# Altium project LOAD CONTROL_Final.PrjPcb
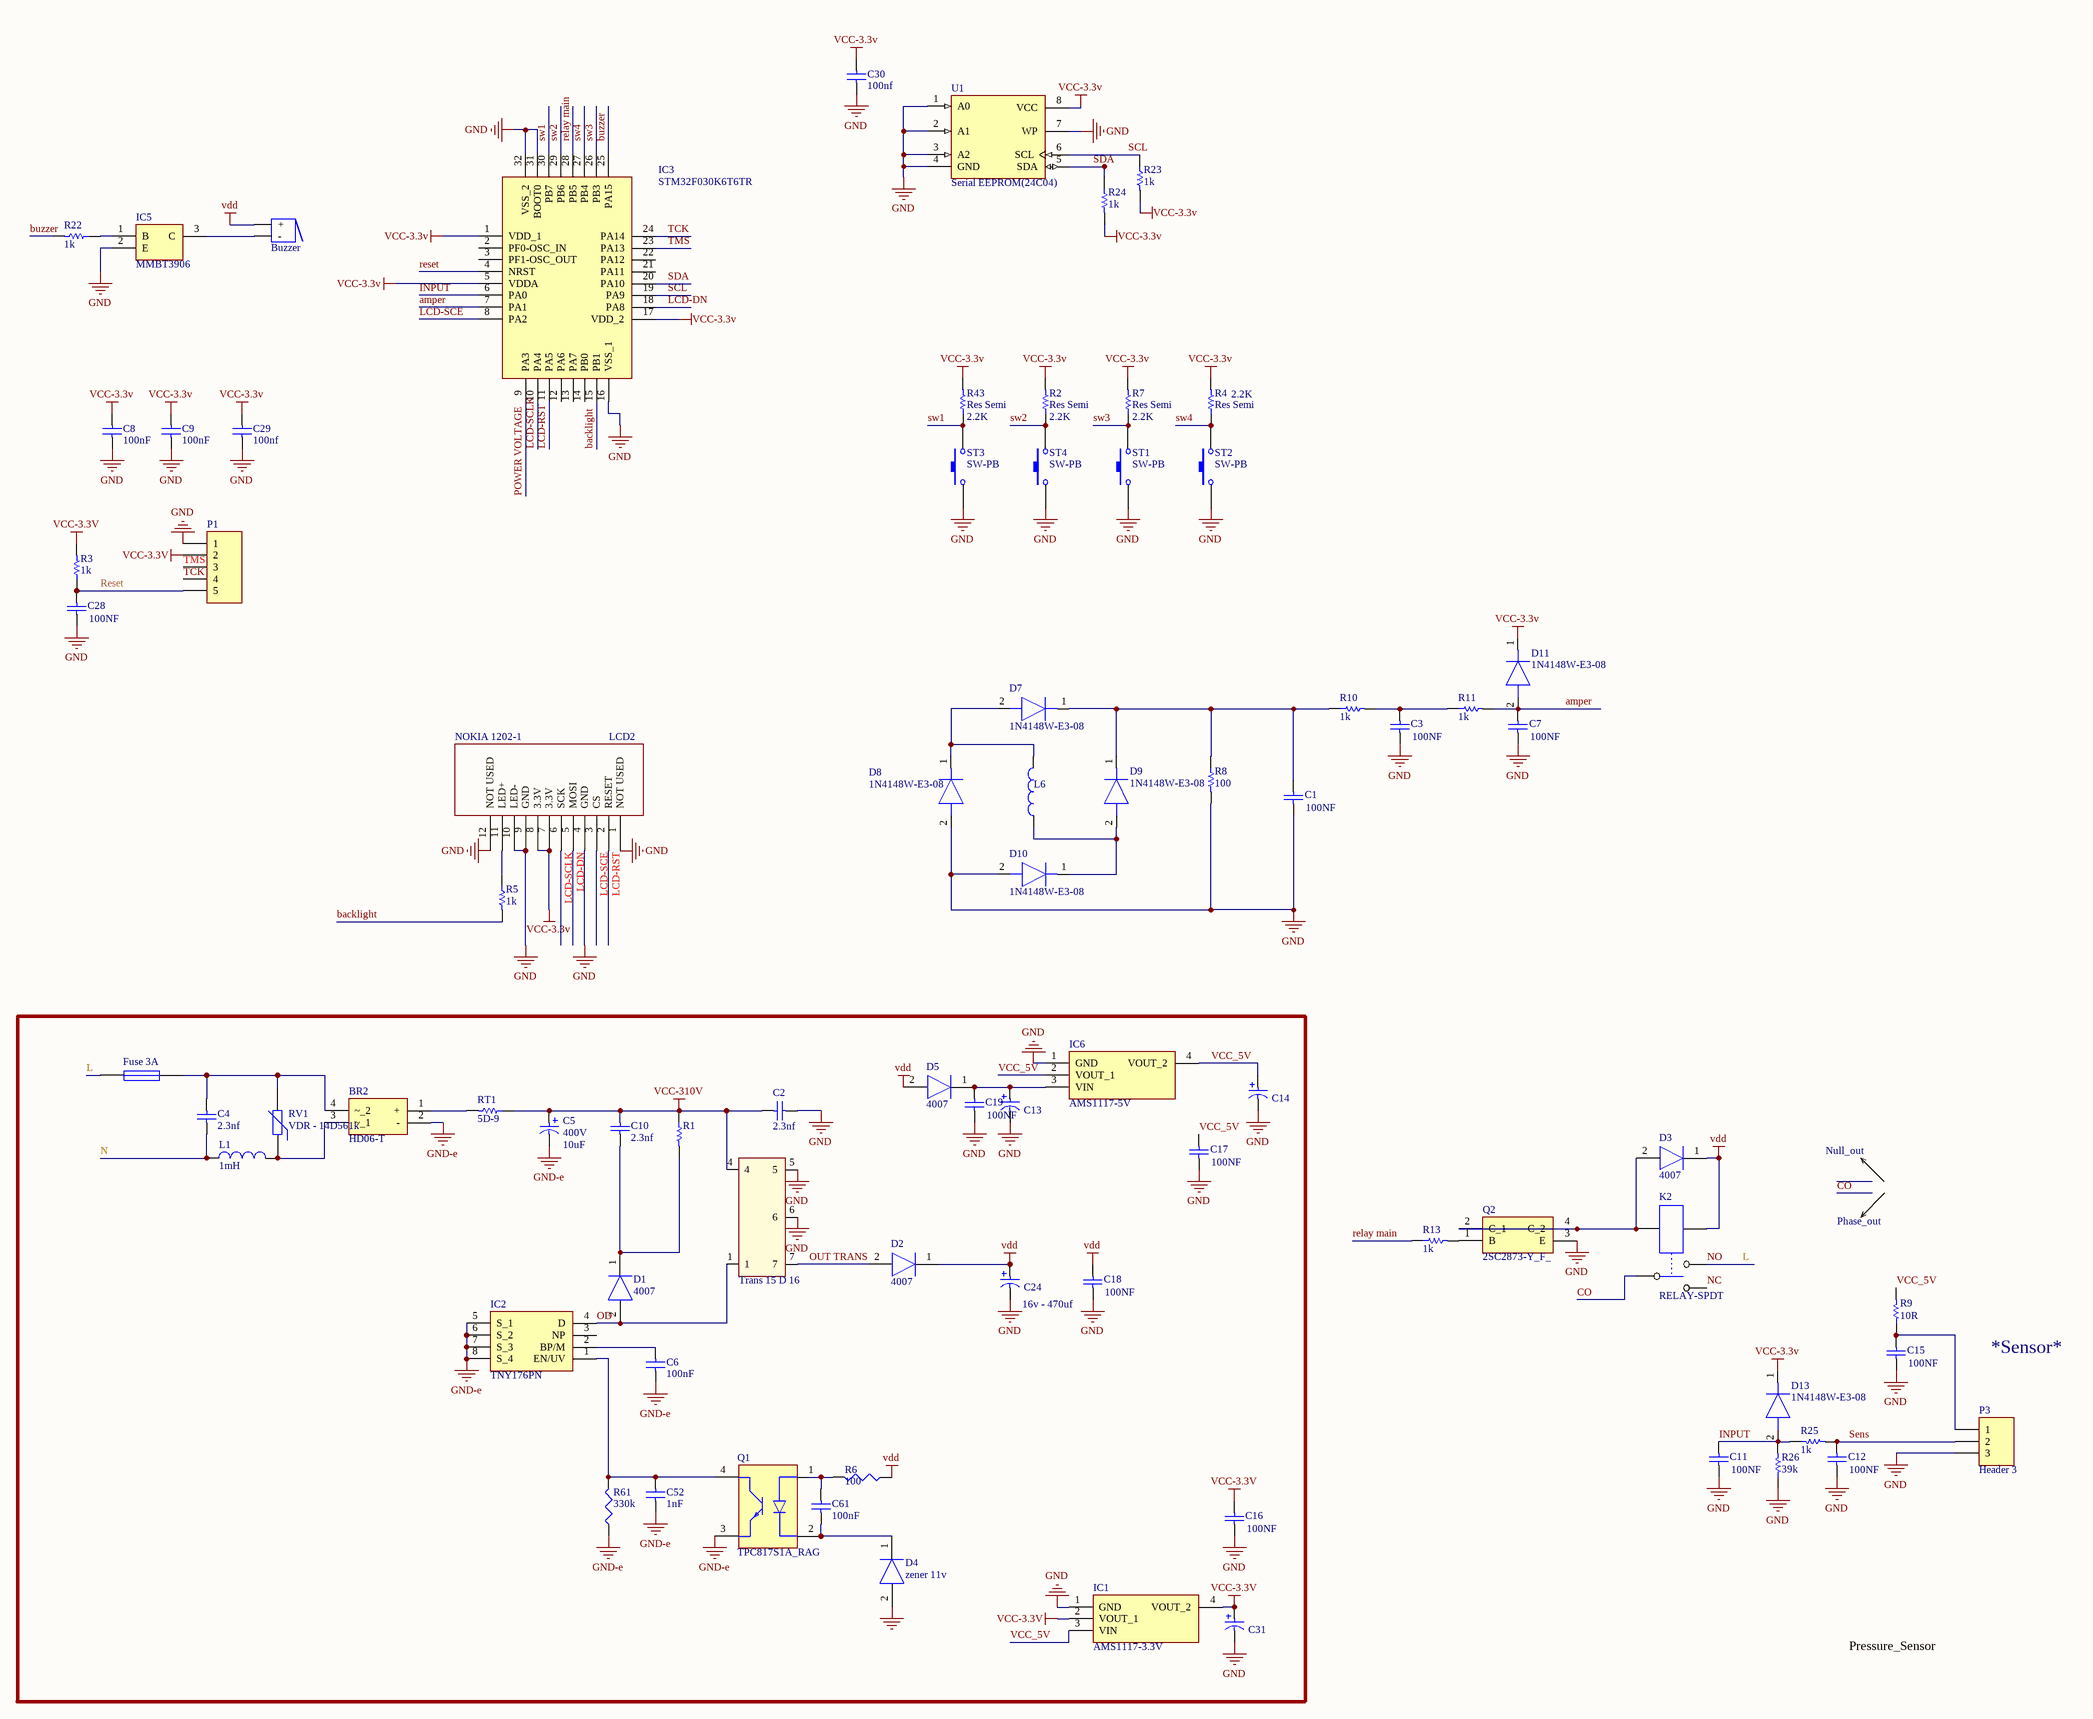
[diagram p0: LOAD CONTROL_Final2.SchDoc]
1 sheet, 80 parts. Net scope: global (net labels, ports and power ports of the same name join across sheets).
Board file: LOAD CONTROL_Final2.PcbDoc

## Sheet LOAD CONTROL_Final2.SchDoc
size A2

### Parts
BR2  HD06-T  [SOP250P700X270-4N]
Buzzer  Buzzer  [BUZZER]  (value not drawn)
C1  100NF  [c1206]
C2  2.3nf  [VAR 5MM]
C3  100NF  [c1206]
C4  2.3nf  [VAR 5MM]
C5  400V  value 10uF  [RADIAL 12MM]
C6  100nF  [C1206]
C7  100NF  [c1206]
C8  100nF  [c1206]
C9  100nF  [c1206]
C10  2.3nf  [VAR 5MM]
C11  100NF  [c1206]
C12  100NF  [c1206]
C13  35v - 100uf  [RADIAL 5MM]  (value not drawn)
C14  35v - 100uf  [RADIAL 5MM]  (value not drawn)
C15  100NF  [c1206]
C16  100NF  [c1206]
C17  100NF  [c1206]
C18  100NF  [c1206]
C19  100NF  [c1206]
C24  16v - 470uf  [RADIAL 5MM]
C28  100NF  [c1206]
C29  100nf  [c1206]
C30  100nf  [C1206]
C31  35v - 100uf  [RADIAL 5MM]  (value not drawn)
C52  1nF  [c1206]
C61  100nF  [c1206]
D1  4007  [sma]
D2  4007  [sma]
D3  4007  [sma]
D4  zener 11v  [SOD3716X135N]
D5  4007  [sma]
D7  1N4148W-E3-08  [SOD3716X135N]
D8  1N4148W-E3-08  [SOD3716X135N]
D9  1N4148W-E3-08  [SOD3716X135N]
D10  1N4148W-E3-08  [SOD3716X135N]
D11  1N4148W-E3-08  [SOD3716X135N]
D13  1N4148W-E3-08  [SOD3716X135N]
Fuse_3A  Fuse 1  [FUSE1206]  (value not drawn)
IC1  AMS1117-3.3V  [SOT229P700X180-4N]
IC2  TNY176PN  [DIP8]
IC3  STM32F030K6T6TR  [QFP80P900X900X160-32N]
IC5  MMBT3906  [SOT95P240X120-3N]
IC6  AMS1117-5V  [SOT229P700X180-4N]
K2  RELAY-SPDT  [T91]
L1  1mH  [inductor 0.25w]
L6  0  [ZMC]  (value not drawn)
NOKIA_1202-1  LCD2  [LCD NOKIA 1202]
P1  Header 5  [HDR1X5]  (value not drawn)
P3  Header 3  [3PIN]
Q1  TPC817S1A_RAG  [SOP259P1005X368-4N]
Q2  2SC2873-Y_F_  [2SC5819TE12LF]
R1  0.22 oh _ 5%  [RES 2W H]  (value not drawn)
R2  Res Semi  value 2.2K  [R1206]
R3  value 1k  [R1206]  (hidden comment: Res Semi)
R4  Res Semi  value 2.2K  [R1206]
R5  value 1k  [R1206]  (hidden comment: Res Semi)
R6  value 100  [R1206]  (hidden comment: 1206)
R7  Res Semi  value 2.2K  [R1206]
R8  value 100  [R1206]  (hidden comment: Res Semi)
R9  value 10R  [R1206]  (hidden comment: Res Semi)
R10  value 1k  [R1206]  (hidden comment: Res Semi)
R11  value 1k  [R1206]  (hidden comment: Res Semi)
R13  value 1k  [R1206]  (hidden comment: Res Semi)
R22  value 1k  [R1206]  (hidden comment: Res Semi)
R23  value 1k  [R1206]  (hidden comment: Res Semi)
R24  value 1k  [R1206]  (hidden comment: Res Semi)
R25  value 1k  [R1206]  (hidden comment: Res Semi)
R26  value 39k  [R1206]  (hidden comment: Res Semi)
R43  Res Semi  value 2.2K  [R1206]
R61  330k  [R1206]
RT1  5D-9  [VAR 5MM]
RV1  VDR - 14D561k  [VAR 5MM]
ST1  SW-PB  [PUSH BOTTOM 6*6]
ST2  SW-PB  [PUSH BOTTOM 6*6]
ST3  SW-PB  [PUSH BOTTOM 6*6]
ST4  SW-PB  [PUSH BOTTOM 6*6]
TR1  Trans 15 D 16  [EE20]
U1  Serial EEPROM(24C04)  [SO8_L]

### Nets
GND: C1.1 C2.2 C3.1 C7.1 C8.2 C9.2 C11.1 C12.1 C13.1 C14.1 C15.1 C16.1 C17.1 C18.1 C19.1 C24.1 C28.1 C29.1 C30.1 C31.1 D4.2(A) D8.2(A) D10.2(A) IC1.1(GND) IC3.16(VSS_1) IC3.31(BOOT0) IC3.32(VSS_2) IC5.2(E) IC6.1(GND) NOKIA_1202-1.1(NOT_USED) NOKIA_1202-1.4(GND) NOKIA_1202-1.9(GND) NOKIA_1202-1.10(LED-) NOKIA_1202-1.12(NOT_USED) P1.1 P3.3 Q2.3(E) R8.2 R26.1 ST1.1 ST2.1 ST3.1 ST4.1 TR1.5 TR1.6 U1.1(A0) U1.2(A1) U1.3(A2) U1.4(GND) U1.7(WP)
GND-e: BR2.2(-) C5.2 C6.2 C52.2 IC2.5(S_1) IC2.6(S_2) IC2.7(S_3) IC2.8(S_4) Q1.3(EMITTER) R61.1
VCC-3.3V: C8.1 C9.1 C16.2 C29.2 C30.2 C31.2 D11.1(K) D13.1(K) IC1.2(VOUT_1) IC1.4(VOUT_2) IC3.1(VDD_1) IC3.5(VDDA) IC3.17(VDD_2) NOKIA_1202-1.7(3.3V) NOKIA_1202-1.8(3.3V) P1.2 R2.2 R3.2 R4.2 R7.2 R23.2 R24.2 R43.2 U1.8(VCC)
VCC-310V: C2.1 C5.1 C10.1 R1.1 RT1.1 TR1.4
vdd: Buzzer.1(+) C18.2 C24.2 D2.1(K) D3.1(K) D5.2(A) K2.5 R6.1
amper: C7.2 D11.2(A) IC3.7(PA1) R11.2
backlight: IC3.15(PB1) R5.2
buzzer: IC3.25(PA15) R22.2
CO: K2.1
INPUT: C11.2 D13.2(A) IC3.6(PA0) R25.1 R26.2
L: Fuse_3A.1 K2.3  [also labelled NO]
LCD-DN: IC3.18(PA8) NOKIA_1202-1.5(MOSI)
LCD-RST: IC3.11(PA5) NOKIA_1202-1.2(RESET)
LCD-SCE: IC3.8(PA2) NOKIA_1202-1.3(CS)
LCD-SCLK: IC3.10(PA4) NOKIA_1202-1.6(SCK)
N: C4.2 L1.1
NC: K2.2
OD: D1.2(A) IC2.4(D) TR1.1
OUT TRANS: D2.2(A) TR1.7
POWER VOLTAGE: IC3.9(PA3)
relay main: IC3.28(PB5) R13.1
Reset: C28.2 IC3.4(NRST) P1.5 R3.1
SCL: IC3.19(PA9) R23.1 U1.6(SCL)
SDA: IC3.20(PA10) R24.1 U1.5(SDA)
Sens: C12.2 P3.2 R25.2
sw1: IC3.30(PB7) R43.1 ST3.2
sw2: IC3.29(PB6) R2.1 ST4.2
sw3: IC3.26(PB3) R7.1 ST1.2
sw4: IC3.27(PB4) R4.1 ST2.2
TCK: IC3.24(PA14) P1.4
TMS: IC3.23(PA13) P1.3
VCC_5V: C14.2 C17.2 IC1.3(VIN) IC6.2(VOUT_1) IC6.4(VOUT_2) R9.2
NetBR2_1: BR2.1(+) RT1.2
NetBR2_3: BR2.3(~_1) L1.2 RV1.1
NetBR2_4: BR2.4(~_2) C4.1 Fuse_3A.2 RV1.2
NetBuzzer_2: Buzzer.2(-) IC5.3(C)
NetC1_2: C1.2 D7.1(K) D9.1(K) R8.1 R10.1
NetC3_2: C3.2 R10.2 R11.1
NetC6_1: C6.1 IC2.2(BP/M)
NetC10_2: C10.2 D1.1(K) R1.2
NetC13_2: C13.2 C19.2 D5.1(K) IC6.3(VIN)
NetC15_2: C15.2 P3.1 R9.1
NetC52_1: C52.1 IC2.1(EN/UV) Q1.4(COLLECTOR) R61.2
NetC61_1: C61.1 Q1.1(ANODE) R6.2
NetC61_2: C61.2 D4.1(K) Q1.2(CATHODE)
NetD3_2: D3.2(A) K2.4 Q2.2(C_1) Q2.4(C_2)
NetD7_2: D7.2(A) D8.1(K) L6.2
NetD9_2: D9.2(A) D10.1(K) L6.1
NetIC5_1: IC5.1(B) R22.1
NetNOKIA_1202-1_11: NOKIA_1202-1.11(LED+) R5.1
NetQ2_1: Q2.1(B) R13.2

Not connected (* = marked no-connect by the designer): IC2 3(NP); IC3 2(PF0-OSC_IN) 3(PF1-OSC_OUT) 12(PA6) 13(PA7) 14(PB0) 21(PA11) 22(PA12)

### Notes on the sheet
- Null_out
- Phase_out
- *Sensor*
- Pressure_Sensor

### Library data of the parts
BR2 = HD06-T: Bridge Rectifier; Manufacturer_Name: Diodes Inc.; Allied_Number: 70438301; Datasheet Link: https://www.diodes.com/assets/Datasheets/ds17003.pdf; Height: 2.7mm; Manufacturer_Part_Number: HD06-T; Mouser Part Number: 621-HD06T; Mouser Price/Stock: https://www.mouser.com/Search/Refine.aspx?Keyword=621-HD06T; RS Part Number: 7385033; RS Price/Stock: https://uk.rs-online.com/web/p/products/7385033; Allied Price/Stock: https://www.alliedelec.com/diodes-inc-hd06-t/70438301/
Buzzer = Buzzer: Designer: Seyed Mohsen Ghasemain; ComponentLinkURL: www.picpars.com
C1 C3 C6-C9 C11 C12 C15-C19 C28-C30 C52 C61 = Cap Semi: Capacitor (Semiconductor SIM Model); Value: 10PF; Published: 8-Jun-2000; LatestRevisionDate: 29-May-2009; LatestRevisionNote: IPC-7351 Footprint Added.; PackageReference: C1206; Publisher: Altium Limited; PackageDescription: Chip Capacitor
C2 C4 C10 = Cap: Capacitor - SMD; Value: 100pF; Published: 8-Jun-2000; LatestRevisionDate: 17-Jul-2002; LatestRevisionNote: Re-released for DXP Platform.; PackageReference: RAD-0.3; Publisher: Altium Limited; PackageDescription: Radial Cap, Thru-Hole; 2 Leads; 0.3 in Pin Spacing
C5 = CAP_22uF_400V
C13 C14 C24 C31 = CAP 470uF 16V: Electrolytic Capacitor; Value: 1500uF
D1-D5 = 1N5819HW-7-F: Diode; Manufacturer_Name: Diodes Inc.; Allied_Number: 70437201; Datasheet Link: http://www.diodes.com/_files/datasheets/ds30217.pdf; Height: 1.45mm; Manufacturer_Part_Number: 1N5819HW-7-F; Mouser Part Number: 621-1N5819HW-F; Mouser Price/Stock: https://www.mouser.com/Search/Refine.aspx?Keyword=621-1N5819HW-F; RS Part Number: 7082197P; RS Price/Stock: http://uk.rs-online.com/web/p/products/7082197P; Allied Price/Stock: http://www.alliedelec.com/diodes-inc-1n5819hw-7-f/70437201/
D7-D11 D13 = 1N4148W-E3-08: Diode; Manufacturer_Name: Vishay; Datasheet Link: http://www.vishay.com/docs/85748/1n4148w.pdf; Height: 1.35mm; Manufacturer_Part_Number: 1N4148W-E3-08; Mouser Part Number: 78-1N4148W-E3-08; Mouser Price/Stock: https://www.mouser.co.uk/ProductDetail/Vishay-Semiconductors/1N4148W-E3-08?qs=bTzheeSci6TVjpxfjjRVMw%3D%3D; Arrow Part Number: 1N4148W-E3-08; Arrow Price/Stock: https://www.arrow.com/en/products/1n4148w-e3-08/vishay?region=nac
Fuse_3A = Fuse 1: Fuse; Published: 8-Jun-2000; LatestRevisionDate: 17-Jul-2002; LatestRevisionNote: Re-released for DXP Platform.; PackageReference: PIN-W2/E2.8; Publisher: Altium Limited; PackageDescription: Thru-Hole; 2 Leads
IC1 IC6 = AMS1117-3.3: Integrated Circuit; Manufacturer_Name: Advanced Monolithic Systems; Datasheet Link: http://www.advanced-monolithic.com/pdf/ds1117.pdf; Height: 1.8mm; Manufacturer_Part_Number: AMS1117-3.3
IC2 = TNY278PN: Integrated Circuit; Manufacturer_Name: Power Integrations; Datasheet Link: https://www.power.com/sites/default/files/product-docs/tny274-280.pdf; Height: 4.06mm; Manufacturer_Part_Number: TNY278PN; Mouser Part Number: 869-TNY278PN; Mouser Price/Stock: https://www.mouser.com/Search/Refine.aspx?Keyword=869-TNY278PN; RS Part Number: 0533721; RS Price/Stock: http://uk.rs-online.com/web/p/products/0533721
IC3 = STM32F030K6T6TR: Integrated Circuit; Manufacturer_Name: STMicroelectronics; Datasheet Link: http://www.st.com/content/ccc/resource/technical/document/datasheet/a4/5d/0b/0e/87/c4/4d/71/DM00088500.pdf/files/DM00088500.pdf/jcr:content/translations/en.DM00088500.pdf; Height: 1.6mm; Manufacturer_Part_Number: STM32F030K6T6TR; Mouser Part Number: 511-STM32F030K6T6TR; Mouser Price/Stock: https://www.mouser.co.uk/ProductDetail/STMicroelectronics/STM32F030K6T6TR/?qs=9MuLHSklicort60U4QZudQ%3D%3D; Arrow Part Number: STM32F030K6T6TR; Arrow Price/Stock: https://www.arrow.com/en/products/stm32f030k6t6tr/stmicroelectronics
IC5 = MMBT3906: Transistor; Manufacturer_Name: onsemi; Datasheet Link: http://akizukidenshi.com/download/ds/fairchild/2N3904_MMBT3904_PZT3904.pdf; Height: 1.2mm; Manufacturer_Part_Number: MMBT3906; Mouser Part Number: 512-MMBT3906; Mouser Price/Stock: https://www.mouser.co.uk/ProductDetail/ON-Semiconductor-Fairchild/MMBT3906?qs=UMEuL5FsraBPiZDsobnR3A%3D%3D; Arrow Part Number: MMBT3906; Arrow Price/Stock: https://www.arrow.com/en/products/mmbt3906/on-semiconductor
L1 = Inductor: Code_IEC: 1005; Value: 10mH; Published: 8-Jun-2000; LatestRevisionDate: 29-May-2009; LatestRevisionNote: IPC-7351 Footprint Added.; PackageReference: 0402-A; Publisher: Altium Limited; PackageDescription: Chip Inductor; Code_JEITA: 0402
L6 = Inductor: Code_IEC: 1005; Value: 300uH; Published: 8-Jun-2000; LatestRevisionDate: 29-May-2009; LatestRevisionNote: IPC-7351 Footprint Added.; PackageReference: 0402-A; Publisher: Altium Limited; PackageDescription: Chip Inductor; Code_JEITA: 0402
NOKIA_1202-1 = NOKIA 1202
P1 = Header 5: Header, 5-Pin; LatestRevisionDate: 17-Jul-2002; LatestRevisionNote: Re-released for DXP Platform.; Publisher: Altium Limited
P3 = Header 3: Header, 3-Pin; LatestRevisionDate: 17-Jul-2002; LatestRevisionNote: Re-released for DXP Platform.; Publisher: Altium Limited
Q1 = TPC817S1A_RAG: Transistor; Manufacturer_Name: Taiwan Semiconductor; Manufacturer_Part_Number: TPC817S1A RAG; Datasheet Link: http://www.taiwansemi.com/products/datasheet/TPC817%20SERIES_C1612.pdf; Height: 3.68mm; Mouser Part Number: 821-TPC817S1ARAG; Mouser Price/Stock: https://www.mouser.com/Search/Refine.aspx?Keyword=821-TPC817S1ARAG
Q2 = 2SC2873-Y_F_: Transistor BJT NPN; Manufacturer_Name: Toshiba; Manufacturer_Part_Number: 2SC2873-Y(F); Datasheet Link: http://toshiba.semicon-storage.com/info/docget.jsp?did=20773&prodName=2SC2873; Height: 1mm
R1 = Res1: Resistor - Deep; Value: 0.22oh; Published: 8-Jun-2000; LatestRevisionDate: 17-Jul-2002; LatestRevisionNote: Re-released for DXP Platform.; PackageReference: AXIAL-0.3; Publisher: Altium Limited; PackageDescription: Axial Device, Thru-Hole; 2 Leads; 0.3 in Pin Spacing
R2-R5 R7-R11 R13 R22-R26 R43 = Res Semi: Semiconductor Resistor; Published: 8-Jun-2000; LatestRevisionDate: 17-Jul-2002; LatestRevisionNote: Re-released for DXP Platform.; PackageReference: AXIAL-0.5; Publisher: Altium Limited
R6 = Res3: Resistor; Published: 8-Jun-2000; LatestRevisionDate: 29-May-2009; LatestRevisionNote: IPC-7351 Footprint Added.; PackageReference: J1-0603; Publisher: Altium Limited; PackageDescription: Chip Resistor
R61 = Res3: Resistor; Value: 10K; Published: 8-Jun-2000; LatestRevisionDate: 29-May-2009; LatestRevisionNote: IPC-7351 Footprint Added.; PackageReference: J1-0603; Publisher: Altium Limited; PackageDescription: Chip Resistor
RT1 = Res1: NTC; Value: 150k; Published: 8-Jun-2000; LatestRevisionDate: 17-Jul-2002; LatestRevisionNote: Re-released for DXP Platform.; PackageReference: AXIAL-0.3; Publisher: Altium Limited; PackageDescription: Axial Device, Thru-Hole; 2 Leads; 0.3 in Pin Spacing
RV1 = Res Varistor: Varistor (Voltage-Sensitive Resistor); Published: 24-Mar-1999; LatestRevisionDate: 29-May-2009; LatestRevisionNote: IPC-7351 Footprint Added.; PackageVersion: Mar-2003; PackageReference: 6-0805; Publisher: Altium Limited; PackageDescription: Chip Resistor 0805 Case Size; Code_IPC: RESC2012
ST1-ST4 = SW-PB: Switch; Published: 24-Mar-1999; LatestRevisionDate: 17-Jul-2002; LatestRevisionNote: Re-released for DXP Platform.; PackageReference: SPST-2; Publisher: Altium Limited; PackageDescription: Switch; 2 Leads
U1 = AT24C512: EEPROM